# Altium schematic sheet Sheet2.SchDoc
size A; SheetNumber: 1; SheetTotal: 1
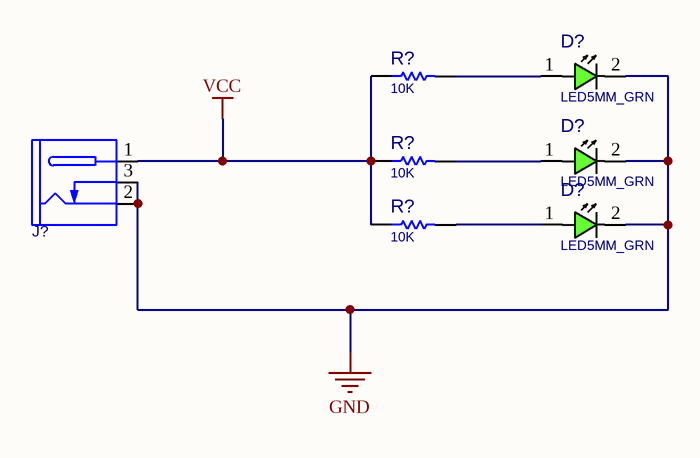
[diagram p0: Sheet2.SchDoc]

## Parts
(Parts that share a designator on the sheet are numbered #1, #2 ... from top to bottom, then left to right.)
D?#1  LED5MM_GRN  [LED5MM_GRN]
D?#2  LED5MM_GRN  [LED5MM_GRN]
D?#3  LED5MM_GRN  [LED5MM_GRN]
J?  DC_POWER_JACK  [JAC_PWR1]  (value not drawn)
R?#1  10K  [R025W_AX04]
R?#2  10K  [R025W_AX04]
R?#3  10K  [R025W_AX04]

## Nets
GND: D?#1.2(CATHODE) D?#2.2(CATHODE) D?#3.2(CATHODE) J?.2(SLEEVE) J?.3(INSERTION_DET)
VCC: J?.1(TIP) R?#1.1 R?#2.1 R?#3.1
NetD?#1_1: D?#1.1(ANODE) R?#1.2
NetD?#2_1: D?#2.1(ANODE) R?#2.2
NetD?#3_1: D?#3.1(ANODE) R?#3.2

## Library data of the parts
D?#1-D?#3 = LED_THD_5MM_GRN: LED, THD, 5MM, GREEN; DESC: DESCRIPTION; MANF_P#: MANF_PART#; PARAM2: 2.2V; MANF: MANF; ASSEMBLY: ASSEMBLY; PRICE: PRICE; VALUE: LED5MM_GRN
J? = CONN_PWR_JACKR1: CONN, PWR JACK DC, PLUG DIAM 1.0MM RA THD; MANF: CUI STACK; MANF_P#: PJ-031CH, PJ-031C; PARAM: CH 3A, C 2A; VALUE: DC_POWER_JACK
R?#1-R?#3 = RES_THD: RESISTOR, THD; MANF_P#: RK73H1ETTP4701F; MANF: KOA SPEER; PARAM: 0.063W; DESC: DESCRIPTION; DIST#: MOUSER; PARAM2: 1%; ASSEMBLY: ASSEMBLY; PRICE: 100= 0.5$; VALUE: 10K